# EAGLE design Rain_Sensor (EAGLE 9.5.2)
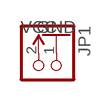
[diagram p0: schematic, sheet 1]

## Parts
JP1  PINHD-1X2  [1X02]

## Nets
GND: JP1.1
VCC: JP1.2

## Library data of the parts
JP1 = DC_LOAD_AU:PINHD-1X2: PIN HEADER

## Board
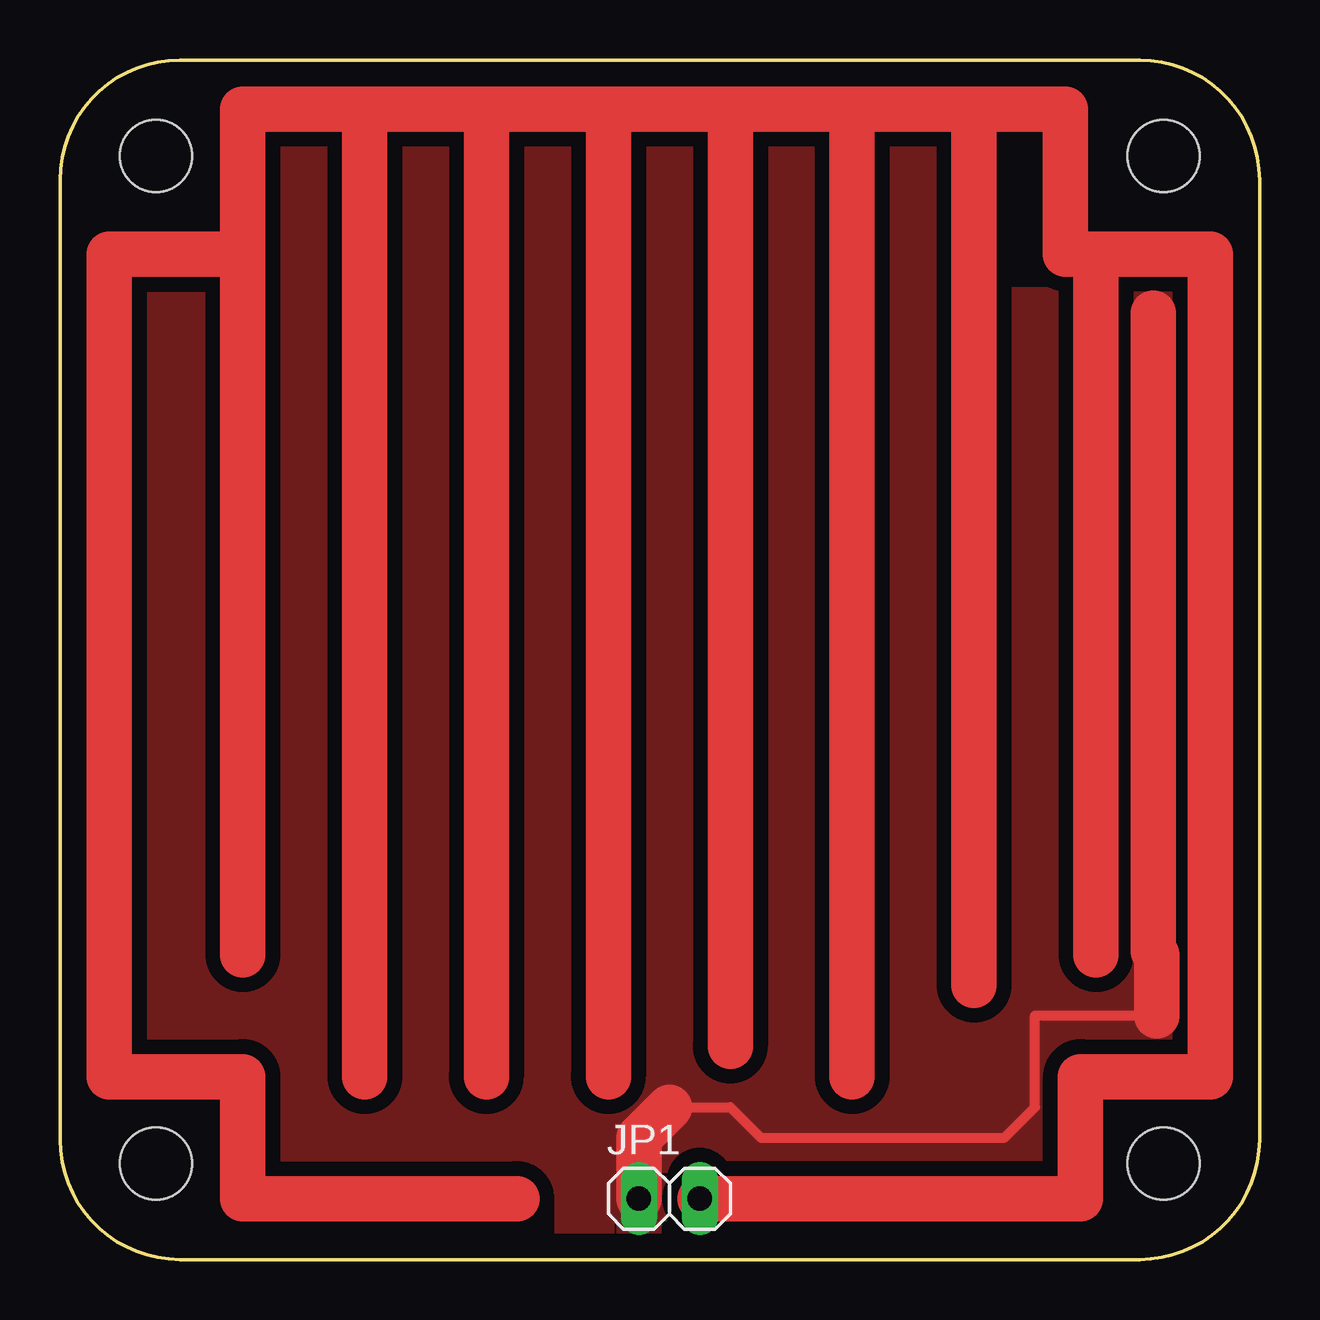
[diagram p1: board, top side]

Size 50 x 50 mm. Coordinates in mm from the lower left corner, seen from the top.
Outline: 5,0 arc-90 0,5 0,45 arc-90 5,50 45,50 arc-90 50,45 50,5 arc-90 45,0 5,0
Copper layers (1*16): Top 0.035mm / dielectric 0.15mm / Bottom 0.035mm
Design rules "default": minimum track width 6mil, minimum drill 0.35mm, track to track 6mil, track to pad 6mil, pad to pad 6mil, via to via 6mil, smd to smd 6mil, copper to edge 40mil, drill to drill 6mil, minimum pad ring 10mil, minimum via ring 8mil, stop-mask expansion 4mil, vias tented up to drill 0mil, thermal gap 10mil
Holes 3 mm at 4,46 46,46 46,4 4,4

### Footprints (pad centres in the part's own frame; a part is rotated, then mirrored left to right if it is on the bottom)
1X02 = drill 1.016 long: 1 -1.27,0; 2 1.27,0

### Placement (x,y rotation side)
JP1  25.4,2.54 0 top

### Tracks (layer width: path | path; a pad name or v marks a point on that pad's centre or on a via)
GND
  Top 0.406: 25.4,6.35 27.94,6.35 29.21,5.08 39.37,5.08 40.64,6.35 40.64,10.16 45.72,10.16
  Top 1.905: JP1.1 24.13,5.08 25.4,6.35 | 45.72,10.16 45.72,12.7 45.57,12.85 45.57,39.45
  pour Top (isolate 0.61): -2.54,52.07 51.82,52.07 arc-90 52.07,51.82 52.07,-2.54 -2.29,-2.54 arc-90 -2.54,-2.29
VCC
  Top 1.905: JP1.2 42.53,2.54 42.53,7.62 47.95,7.62 47.95,41.91 43.18,41.91 | 38.1,47.95 41.91,47.95 41.91,41.91 43.18,41.91 | 38.1,47.95 33.02,47.95 | 33.02,47.95 27.94,47.95 | 27.94,47.95 22.86,47.95 | 22.86,47.95 17.78,47.95 | 17.78,47.95 12.7,47.95 | 12.7,47.95 7.62,47.95 7.62,41.91 | 7.62,41.91 2.04,41.91 2.04,7.62 7.62,7.62 7.62,2.54 19.05,2.54 | 7.62,41.91 7.62,12.7 | 12.7,47.95 12.7,7.62 | 17.78,47.95 17.78,7.62 | 22.86,47.95 22.86,7.62 | 27.94,47.95 27.94,8.89 | 33.02,47.95 33.02,7.62 | 38.1,47.95 38.1,11.43 | 43.18,41.91 43.18,12.7